# Altium schematic sheet analog_pwr.SchDoc
size B
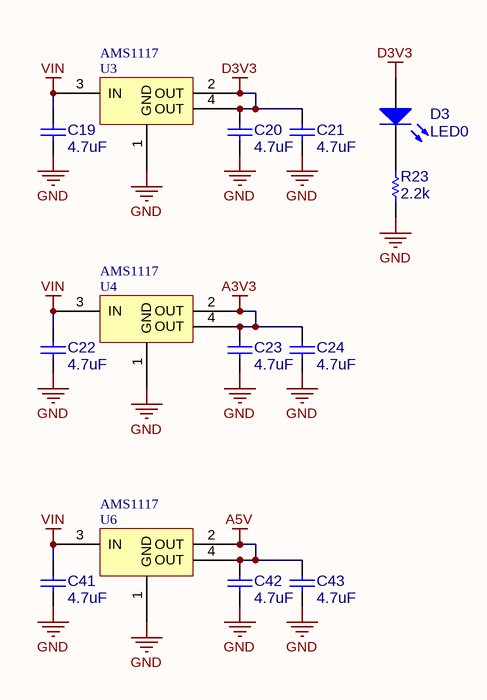
[diagram p0: analog_pwr.SchDoc]

## Parts
C19  4.7uF  [TANT_B]
C20  4.7uF  [C0603]
C21  4.7uF  [TANT_B]
C22  4.7uF  [TANT_B]
C23  4.7uF  [C0603]
C24  4.7uF  [TANT_B]
C41  4.7uF  [TANT_B]
C42  4.7uF  [C0603]
C43  4.7uF  [TANT_B]
D3  LED0  [LED0603]
R23  2.2k  [R0603]
U3  AMS1117  [SOT223]
U4  AMS1117  [SOT223]
U6  AMS1117  [SOT223]

## Nets
A3V3: C23.1 C24.1 U4.2(OUT) U4.4(OUT)
A5V: C42.1 C43.1 U6.2(OUT) U6.4(OUT)
D3V3: C20.1 C21.1 D3.1(A) U3.2(OUT) U3.4(OUT)
GND: C19.2 C20.2 C21.2 C22.2 C23.2 C24.2 C41.2 C42.2 C43.2 R23.1 U3.1(GND) U4.1(GND) U6.1(GND)
VIN: C19.1 C22.1 C41.1 U3.3(IN) U4.3(IN) U6.3(IN)
NetD3_2: D3.2(K) R23.2

## Library data of the parts
C19-C24 C41-C43 = Cap: Capacitor; Published: 8-Jun-2000; LatestRevisionDate: 17-Jul-2002; LatestRevisionNote: Re-released for DXP Platform.; PackageReference: RAD-0.3; Publisher: Altium Limited; PackageDescription: Radial Cap, Thru-Hole; 2 Leads; 0.3 in Pin Spacing
D3 = LED0: Typical INFRARED GaAs LED; Published: 8-Jun-2000; LatestRevisionDate: 08-Jul-2005; LatestRevisionNote: Mech Layer 1 removed.; PackageReference: LED-0; Publisher: Altium Limited; PackageDescription: LED; 2 Leads
R23 = Res1: Resistor; Published: 8-Jun-2000; LatestRevisionDate: 17-Jul-2002; LatestRevisionNote: Re-released for DXP Platform.; PackageReference: AXIAL-0.3; Publisher: Altium Limited; PackageDescription: Axial Device, Thru-Hole; 2 Leads; 0.3 in Pin Spacing